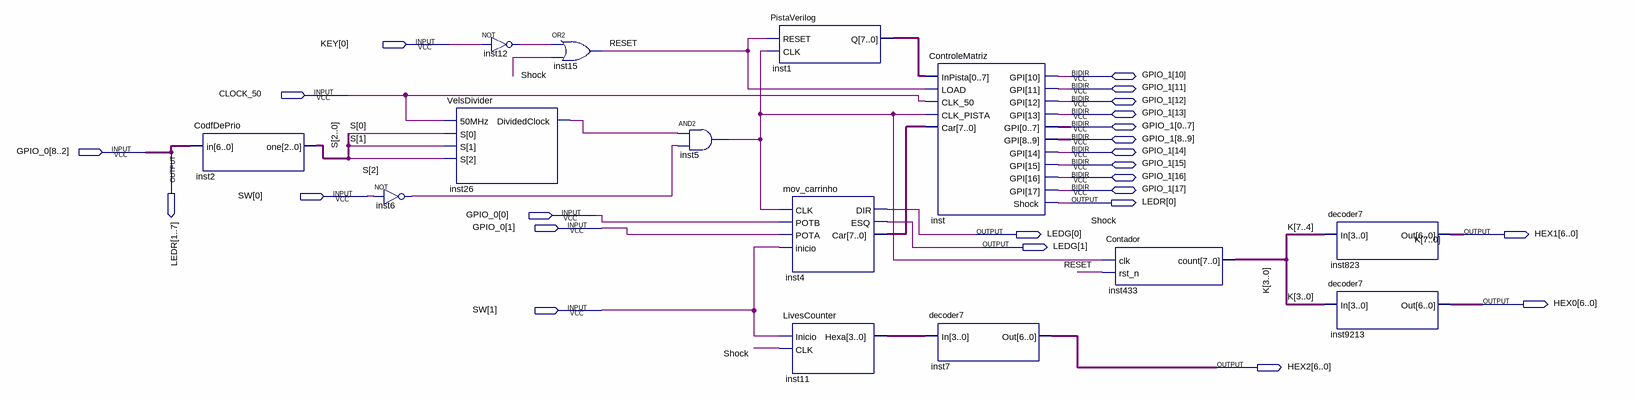
[diagram p0: schematic sheet]
// Quartus schematic test.bdf as structural Verilog: 14 symbols, 24 pins
module test (
  input  [0:0] KEY,
  input  CLOCK_50,
  input  [8:0] GPIO_0,
  input  [1:0] SW,
  inout  [0:17] GPIO_1,
  output [0:7] LEDR,
  output [1:0] LEDG,
  output [6:0] HEX1,
  output [6:0] HEX0,
  output [6:0] HEX2
);

  wire inst5_out, inst6_out, inst12_out, inst26_dividedclock, RESET;
  wire [2:0] S;
  wire [3:0] inst11_hexa;
  wire [7:0] inst1_q, inst4_car, K;

  CodfDePrio inst2 (.in(GPIO_0[8:2]), .one(S));
  not inst6 (inst6_out, SW[0]);
  VelsDivider inst26 (.\50MHz (CLOCK_50), .S(S), .DividedClock(inst26_dividedclock));
  not inst12 (inst12_out, KEY[0]);
  or inst15 (RESET, inst12_out, LEDR[0]);
  and inst5 (inst5_out, inst26_dividedclock, inst6_out);
  PistaVerilog inst1 (.RESET(RESET), .CLK(inst5_out), .Q(inst1_q));
  mov_carrinho inst4 (
    .CLK(inst5_out), .POTB(GPIO_0[0]), .POTA(GPIO_0[1]), .inicio(SW[1]), .DIR(LEDG[0]), .ESQ(LEDG[1]),
    .Car(inst4_car));
  LivesCounter inst11 (.Inicio(SW[1]), .CLK(LEDR[0]), .Hexa(inst11_hexa));
  ControleMatriz inst (
    .InPista(inst1_q), .LOAD(RESET), .CLK_50(CLOCK_50), .CLK_PISTA(inst5_out), .Car(inst4_car),
    .Shock(LEDR[0]),
    .GPI({GPIO_1[17], GPIO_1[16], GPIO_1[15], GPIO_1[14], GPIO_1[13], GPIO_1[12], GPIO_1[11], GPIO_1[10], GPIO_1[9], GPIO_1[8], GPIO_1[7], GPIO_1[6], GPIO_1[5], GPIO_1[4], GPIO_1[3], GPIO_1[2], GPIO_1[1], GPIO_1[0]}));
  decoder7 inst7 (.In(inst11_hexa), .Out(HEX2));
  Contador inst433 (.clk(inst5_out), .rst_n(RESET), .count(K));
  decoder7 inst823 (.In(K[7:4]), .Out(HEX1));
  decoder7 inst9213 (.In(K[3:0]), .Out(HEX0));

  assign LEDR[1:7] = GPIO_0[8:2];

  // Other names for the same wires on the sheet: Shock = LEDR[0]
endmodule
